# EasyEDA Pro project dipan参考PCB.epro

# Schematic Schematic1
Assembly Variant: Basic; Board Name: Board1; Create Date: 2026-07-19; Page Name: P1; Project Name: dipan3.0; Schematic Name: Schematic1; Update Date: 2026-07-19; Company: 嘉立创EDA; Page Size: A4; Version: V1.0
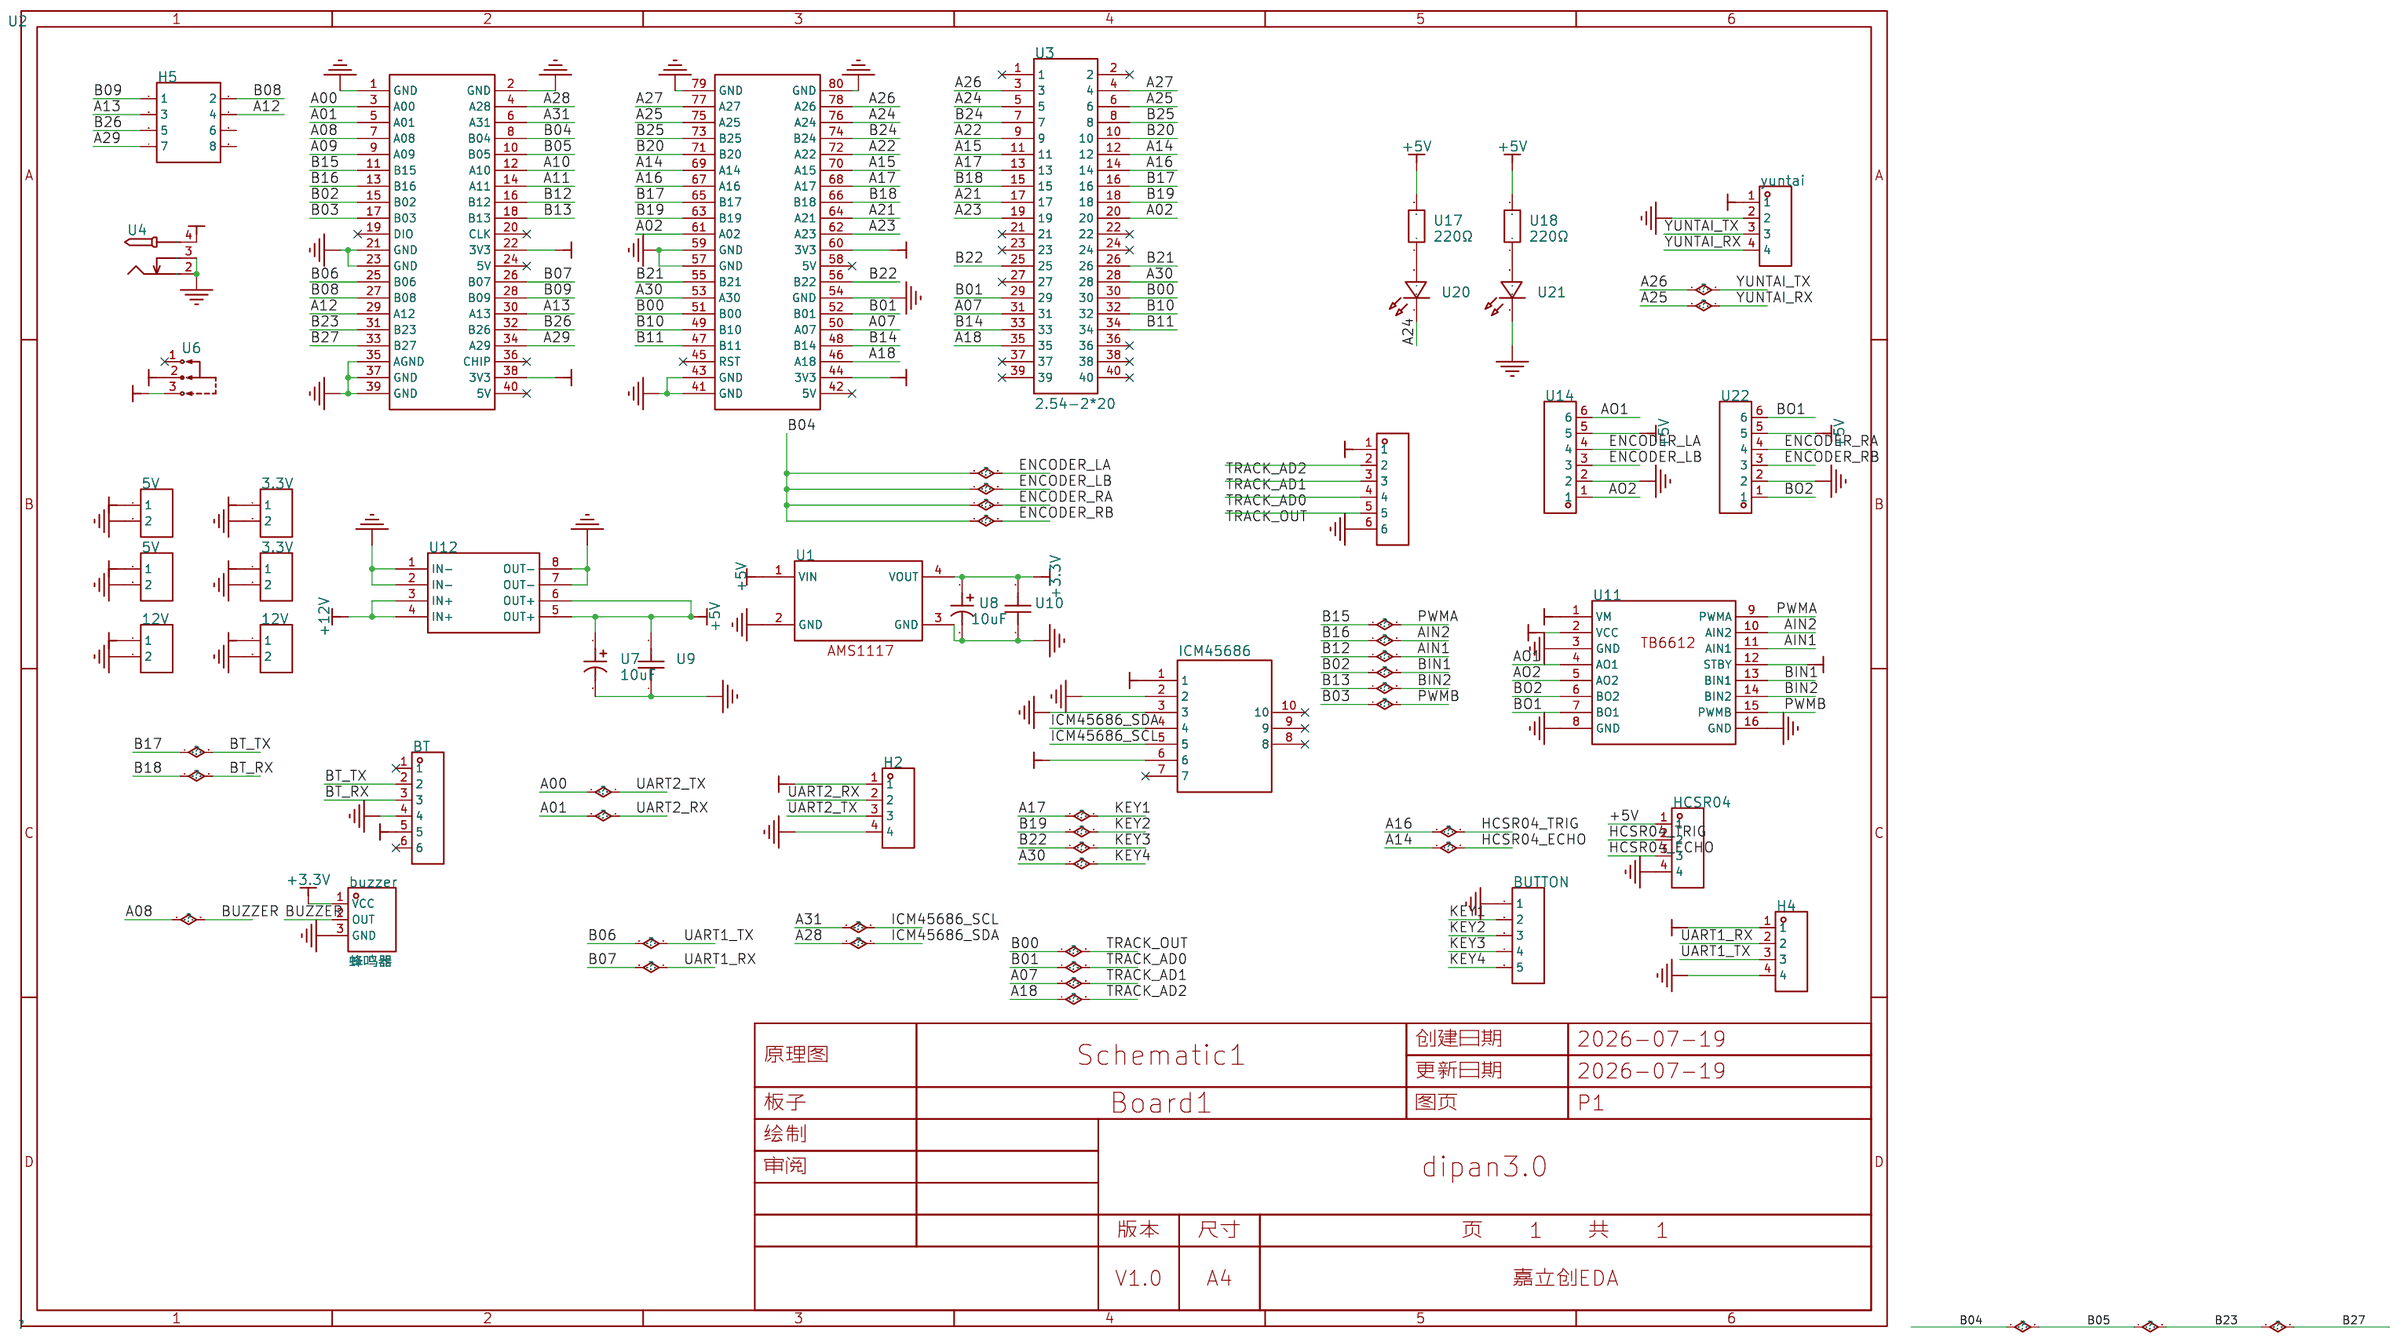
[diagram p0: schematic sheet]

## Parts
3.3V  -  [HDR-TH_2P-P2.54-V-F]
3.3V#2  -  [HDR-TH_2P-P2.54-V-F]
5V  -  [HDR-TH_2P-P2.54-V-F]
5V#2  -  [HDR-TH_2P-P2.54-V-F]
12V  -  [HDR-TH_2P-P2.54-V-F]
12V#2  -  [HDR-TH_2P-P2.54-V-F]
BT  -  [HDR-TH_6P-P2.54-V-F]
BUTTON  -  [HDR-TH_5P-P2.54-V-F]
buzzer  蜂鸣器  [蜂鸣器]
H2  -  [HDR-TH_4P-P2.54-V-F]
H4  -  [HDR-TH_4P-P2.54-V-F]
H5  -  [HDR-TH_8P-P2.54-V-F-R2-C4-S2.54-1]
HCSR04  -  [HDR-TH_4P-P2.54-V-F]
ICM45686  -  [ICM45686]
TRACK  -  [HDR-TH_6P-P2.54-V-F]
U1  -  [AMS1117模块]
U2  LCKFB-TMX-MSPM0G3507  [COMM-TH_LCKFB-TMX-MSPM0G3507]
U3  2.54-2*20  [HDR-TH_40P-P2.54-V-F-R2-C20-S2.54]
U4  DC005-2.5  [DC-IN-TH_DC005-2.5MM]
U6  SS12D10G5  [SW-TH_SHOU-HAN_SS12D10G4]
U7  10uF  [CAP-TH_BD5.0-P2.00-D0.5-FD-1]
U8  10uF  [CAP-TH_BD5.0-P2.00-D0.5-FD-1]
U9  -  [0.1uf陶瓷电容直插]
U10  -  [0.1uf陶瓷电容直插]
U11  -  [TB6612]
U12  -  [MP1584EN降压模块]
U14  ZX-XH2.54-6PWZ  [CONN-TH_6P-P2.50_ZX-XH2.54-6PWZ]
U17  220Ω  [RES-TH_BD2.7-L6.2-P10.20-D0.4]
U18  220Ω  [RES-TH_BD2.7-L6.2-P10.20-D0.4]
U20  LTL-307E  [LED-TH_BD3.0-P2.54-FD]
U21  LTL-307E  [LED-TH_BD3.0-P2.54-FD]
U22  ZX-XH2.54-6PWZ  [CONN-TH_6P-P2.50_ZX-XH2.54-6PWZ]
yuntai  -  [HDR-TH_4P-P2.54-V-F]

## Library data of the parts
3.3V 3.3V#2 5V 5V#2 12V 12V#2 = HDR-F_2.54_1x2P: Supplier Part: C49661; Supplier Footprint: 插件
BT TRACK = HDR-F_2.54_1x6P: Supplier Part: C40877; Supplier Footprint: 插件
BUTTON = HDR-F_2.54_1x5P: Supplier Part: C50950; Supplier Footprint: 插件
buzzer = 蜂鸣器: Supplier Part: C9900010938; Datasheet: https://atta.szlcsc.comnull; Supplier: LCSC
H2 H4 HCSR04 yuntai = HDR-F_2.54_1x4P: Supplier Part: C2718488; Supplier Footprint: 插件
H5 = HDR-F_2.54_2x4: Supplier Part: C92271; Supplier Footprint: 插件
ICM45686 = ICM45686
U1 = AMS1117模块: _: 3
U2 = LCKFB-TMX-MSPM0G3507: 该开发板板载德州仪器的微控制器核心,完美适配电赛指定TI芯片题目的要求。支持Keil、CCS和IAU等环境开发,搭配图形化代码生成工具,无需在意底层驱动,助力快速开发。硬件上带有多电源保护,防反接/防过流/受电压,和三路参考电压选择,降低电衰试错成本。80P引脚的引出方便扩展,提供完善的入门手册和模块移植案例。; LCSC Part Name: 5件套 立创·天猛星MSPM0G3507开发板; Supplier Part: C42378531; Manufacturer: 立创开发板; JLCPCB Part Class: Extended Part; Datasheet: https://item.szlcsc.com/datasheet/LCKFB-TMX-MSPM0G3507/44281600.html; Supplier: LCSC
U3 = 2.54-2*20: 插孔结构:2x20P;间距:2.54mm;行距:2.54mm;圆孔/方孔:方孔;安装类型:直插;排数:双排;总孔位数:40P;额定电流:2.5A;额定电压:-;插孔方向:顶部;塑高:8.5mm;工作温度范围:-40℃~+105℃;; LCSC Part Name: 间距:2.54mm 2x20P 直插; Supplier Part: C2977589; Manufacturer: ZHOURI(洲日); Supplier Footprint: 插件,P=2.54mm; JLCPCB Part Class: 扩展库; Datasheet: https://atta.szlcsc.com/upload/public/pdf/source/20220328/834E302BE3C038BBC5C70F5E02589B1E.pdf; Supplier: LCSC; Holes Structure: 2x20P; Pitch: 2.54mm; Row Spacing: 2.54mm; Circular Hole / Square Hole: 方孔; Mounting Type: 直插; Number of Rows: 双排; Number of Holes: 40P; Current Rating (Max): 2.5A; Holes Direction: 顶部; Insulation Height: 8.5mm; Operating Temperature Range: -40℃~+105℃
U4 = DC005-2.5: 连接器类型:DC电源插座;安装方式:弯插;触点内径:2.5mm;触点外径:6.3mm;额定电流:500mA;额定电压:30V;工作温度范围:-25℃~+70℃;; LCSC Part Name: DC电源插座 内径:2.5mm 外径:6.3mm; Supplier Part: C7507454; Manufacturer: SHOU HAN(首韩); Supplier Footprint: 插件; JLCPCB Part Class: 扩展库; Datasheet: https://atta.szlcsc.com/upload/public/pdf/source/20231013/7634FFE9E6B635EE77C0C008CDC877DB.pdf; Supplier: LCSC; Connector Type: DC电源插座; Mounting Style: 弯插; Inside Contact Diameter: 2.5mm; Outside Contact Diameter: 6.3mm; Current Rating (Max): 500mA; Voltage Rating (Max): 30V; Operating Temperature Range: -25℃~+70℃
U6 = SS12D10G5: 电路结构:单刀双掷;安装方式:直插;额定电流(DC):2A;额定电压(DC):125V;机械寿命:3千次;; LCSC Part Name: 两档立式插件 3脚拨动开关 柄长5.0mm; Supplier Part: C7431054; Manufacturer: SHOU HAN(首韩); Supplier Footprint: 插件; JLCPCB Part Class: 扩展库; Datasheet: https://atta.szlcsc.com/upload/public/pdf/source/20231130/7A3DB6A149BF0A1DCFFE64FFC07FE434.pdf; Supplier: LCSC; Circuit: 单刀双掷; Switch Length: 12.7mm; Switch Width: 6.7mm; Mounting Style: 直插; Current Rating (DC): 2A; Voltage Rating (DC): 125V; Mechanical Life: 3千次; Operating Temperature: -25℃~+70℃
U7 U8 = CV4R7MG511BP: 容值:4.7uF;精度:±20%;额定电压:50V;纹波电流:58mA@100kHz;等效串联电阻(ESR):2.5Ω@100kHz;; LCSC Part Name: 4.7uF ±20% 50V; Supplier Part: C2844413; Manufacturer: TWBOR(伯鸿); Supplier Footprint: 插件,D5xL11mm; JLCPCB Part Class: 扩展库; Datasheet: https://atta.szlcsc.com/upload/public/pdf/source/20210727/C2844413_0C02A797581ED1BB0754F03B8FF69A80.pdf; Supplier: LCSC; Tolerance: ±20%; Voltage Rating: 50V; Ripple Current: 58mA@100kHz; Equivalent Series Resistance(ESR): 2.5Ω@100kHz; Pin Spacing: 2mm; Diameter: 5mm; Height - Seated (Max): 11mm; Lifetime: 5000hrs@105℃; Operating Temperature: -40℃~+105℃
U9 U10 = 0.1uf陶瓷电容直插
U11 = TB6612
U12 = MP1584EN降压模块: _: 3
U14 U22 = ZX-XH2.54-6PWZ: 插针结构:1x6P;间距:2.5mm;安装方式:弯插;参考系列:XH;总PIN数:6P;排数:1;每排PIN数:6;行距:-;额定电流:2A;触头材质:黄铜;触头镀层:锡;工作温度:-25℃~+85℃;; LCSC Part Name: 1x6P 间距:2.5mm 弯插 系列:XH; Supplier Part: C7429645; Manufacturer: Megastar(兆星); Supplier Footprint: 弯插,P=2.5mm; JLCPCB Part Class: 扩展库; Datasheet: https://item.szlcsc.com/datasheet/ZX-XH2.54-6PWZ/8427562.html; Supplier: LCSC; Pins Structure: 1x6P; Pitch: 2.5mm; Mounting Type: 弯插; Reference Series: XH; Number of Pins: 6P; Number of Rows: 1; Number of PINs Per Row: 6; Current Rating: 2A; Contact Material: 黄铜; Contact Plating: 锡; Operating Temperature: -25℃~+85℃; Voltage Rating: 250V; Plastic Material: PA66; Flame Retardant Rating: UL94V-0; Color: 白色; Z-Height of the Board: 5.9mm; X-Length of Bottom Edge on Board (Spacing Line): 17.5mm; Y-Width of Bottom Edge on Board: 7.32mm
U17 U18 = MF1/4W-1K±1%-ST52: 电阻类型:金属膜电阻;阻值:1kΩ;精度:±1%;功率:250mW;温度系数:±100ppm/℃;; LCSC Part Name: 金属膜电阻 1kΩ ±1% 250mW; Supplier Part: C2903245; Manufacturer: VO(翔胜); Supplier Footprint: 插件,D2.7xL6.2mm; JLCPCB Part Class: 扩展库; Datasheet: https://atta.szlcsc.com/upload/public/pdf/source/20200609/C601728_5AA4C0C8E12E11069DA2C3356F29D1F2.pdf; Supplier: LCSC; Type: 金属膜电阻; Tolerance: ±1%; Overload Voltage (Max): 250V; Power(Watts): 250mW; Temperature Coefficient: ±100ppm/℃; Operating Temperature Range: -55℃~+155℃
U20 U21 = LTL-307E: 发光颜色:红色;正向电压(VF):2V;正向电流:20mA;主波长:623nm;透镜颜色:红色透镜;发光强度:19mcd;发光角度:50°;; LCSC Part Name: 直插F5红光LED; Supplier Part: C575489; Manufacturer: LITEON(光宝); Supplier Footprint: 插件; JLCPCB Part Class: 扩展库; Supplier: LCSC; Emitted Color: 红色; Forward Voltage (VF): 2V; Forward Current: 20mA; Dominant Wavelength: 623nm; Peak Wavelength: 635nm; Lens Color: 红色透镜; Luminous Intensity: 19mcd; Viewing Angle: 50°

## Nets
+3.3V: 3.3V.1 3.3V#2.1 buzzer.1(VCC) ICM45686.1 ICM45686.6 U1.4(VOUT) U2.22(3V3) U2.38(3V3) U2.44(3V3) U2.60(3V3) U8.1 U10.2
+5V: 5V.1 5V#2.1 BT.5 H2.1 H4.1 HCSR04.1 TRACK.1 U1.1(VIN) U7.1 U9.2 U11.2(VCC) U11.12(STBY) U12.5(OUT+) U12.6(OUT+) U14.5 U17.2 U18.2 U22.5 yuntai.1
+12V: 12V.1 12V#2.1 U6.3 U11.1(VM) U12.3(IN+) U12.4(IN+)
GND: 3.3V.2 3.3V#2.2 5V.2 5V#2.2 12V.2 12V#2.2 BT.4 BUTTON.1 buzzer.3(GND) H2.4 H4.4 HCSR04.4 ICM45686.2 ICM45686.3 TRACK.6 U1.2(GND) U1.3(GND) U2.1(GND) U2.2(GND) U2.21(GND) U2.23(GND) U2.35(AGND) U2.37(GND) U2.39(GND) U2.41(GND) U2.43(GND) U2.54(GND) U2.57(GND) U2.59(GND) U2.79(GND) U2.80(GND) U4.2 U4.3 U7.2 U8.2 U9.1 U10.1 U11.3(GND) U11.8(GND) U11.16(GND) U12.1(IN-) U12.2(IN-) U12.7(OUT-) U12.8(OUT-) U14.2 U21.1(C) U22.2 yuntai.2
VCC: U4.4 U6.2
A00: H2.3 U2.3(A00)
A01: H2.2 U2.5(A01)
A02: U2.61(A02) U3.20
A07: TRACK.3 U2.50(A07) U3.31
A08: buzzer.2(OUT) U2.7(A08)
A09: U2.9(A09)
A10: U2.12(A10)
A11: U2.14(A11)
A12: H5.4 U2.29(A12)
A13: H5.3 U2.30(A13)
A14: HCSR04.3 U2.69(A14) U3.12
A15: U2.70(A15) U3.11
A16: HCSR04.2 U2.67(A16) U3.14
A17: BUTTON.2 U2.68(A17) U3.13
A18: TRACK.2 U2.46(A18) U3.35
A21: U2.64(A21) U3.17
A22: U2.72(A22) U3.9
A23: U2.62(A23) U3.19
A24: U2.76(A24) U3.5 U20.1(C)
A25: U2.75(A25) U3.6 yuntai.4
A26: U2.78(A26) U3.3 yuntai.3
A27: U2.77(A27) U3.4
A28: ICM45686.4 U2.4(A28)
A29: H5.7 U2.34(A29)
A30: BUTTON.5 U2.53(A30) U3.28
A31: ICM45686.5 U2.6(A31)
AIN1: U2.16(B12) U11.11(AIN1)
AIN2: U2.13(B16) U11.10(AIN2)
AO1: U11.4(AO1) U14.6
AO2: U11.5(AO2) U14.1
B00: TRACK.5 U2.51(B00) U3.30
B01: TRACK.4 U2.52(B01) U3.29
B02: U2.15(B02) U11.13(BIN1)
B03: U2.17(B03) U11.15(PWMB)
B04: U2.8(B04) U2.10(B05) U2.31(B23) U2.33(B27) U14.3 U14.4 U22.3 U22.4
B06: H4.3 U2.25(B06)
B07: H4.2 U2.26(B07)
B08: H5.2 U2.27(B08)
B09: H5.1 U2.28(B09)
B10: U2.49(B10) U3.32
B11: U2.47(B11) U3.34
B13: U2.18(B13) U11.14(BIN2)
B14: U2.48(B14) U3.33
B15: U2.11(B15) U11.9(PWMA)
B17: BT.2 U2.65(B17) U3.16
B18: BT.3 U2.66(B18) U3.15
B19: BUTTON.3 U2.63(B19) U3.18
B20: U2.71(B20) U3.10
B21: U2.55(B21) U3.26
B22: BUTTON.4 U2.56(B22) U3.25
B24: U2.74(B24) U3.7
B25: U2.73(B25) U3.8
B26: H5.5 U2.32(B26)
BO1: U11.7(BO1) U22.6
BO2: U11.6(BO2) U22.1
$1N65: U18.1 U21.2(A)
$1N77: U17.1 U20.2(A)

Not connected (* = marked no-connect by the designer): BT 1* 6*; H5 6 8; ICM45686 7* 8* 9* 10*; U2 19(DIO)* 20(CLK)* 24(5V)* 36(CHIP)* 40(5V)* 42(5V)* 45(RST)* 58(5V)*; U3 1* 2* 21* 22* 23* 24* 27* 36* 37* 38* 39* 40*; U6 1*

# Board PCB1
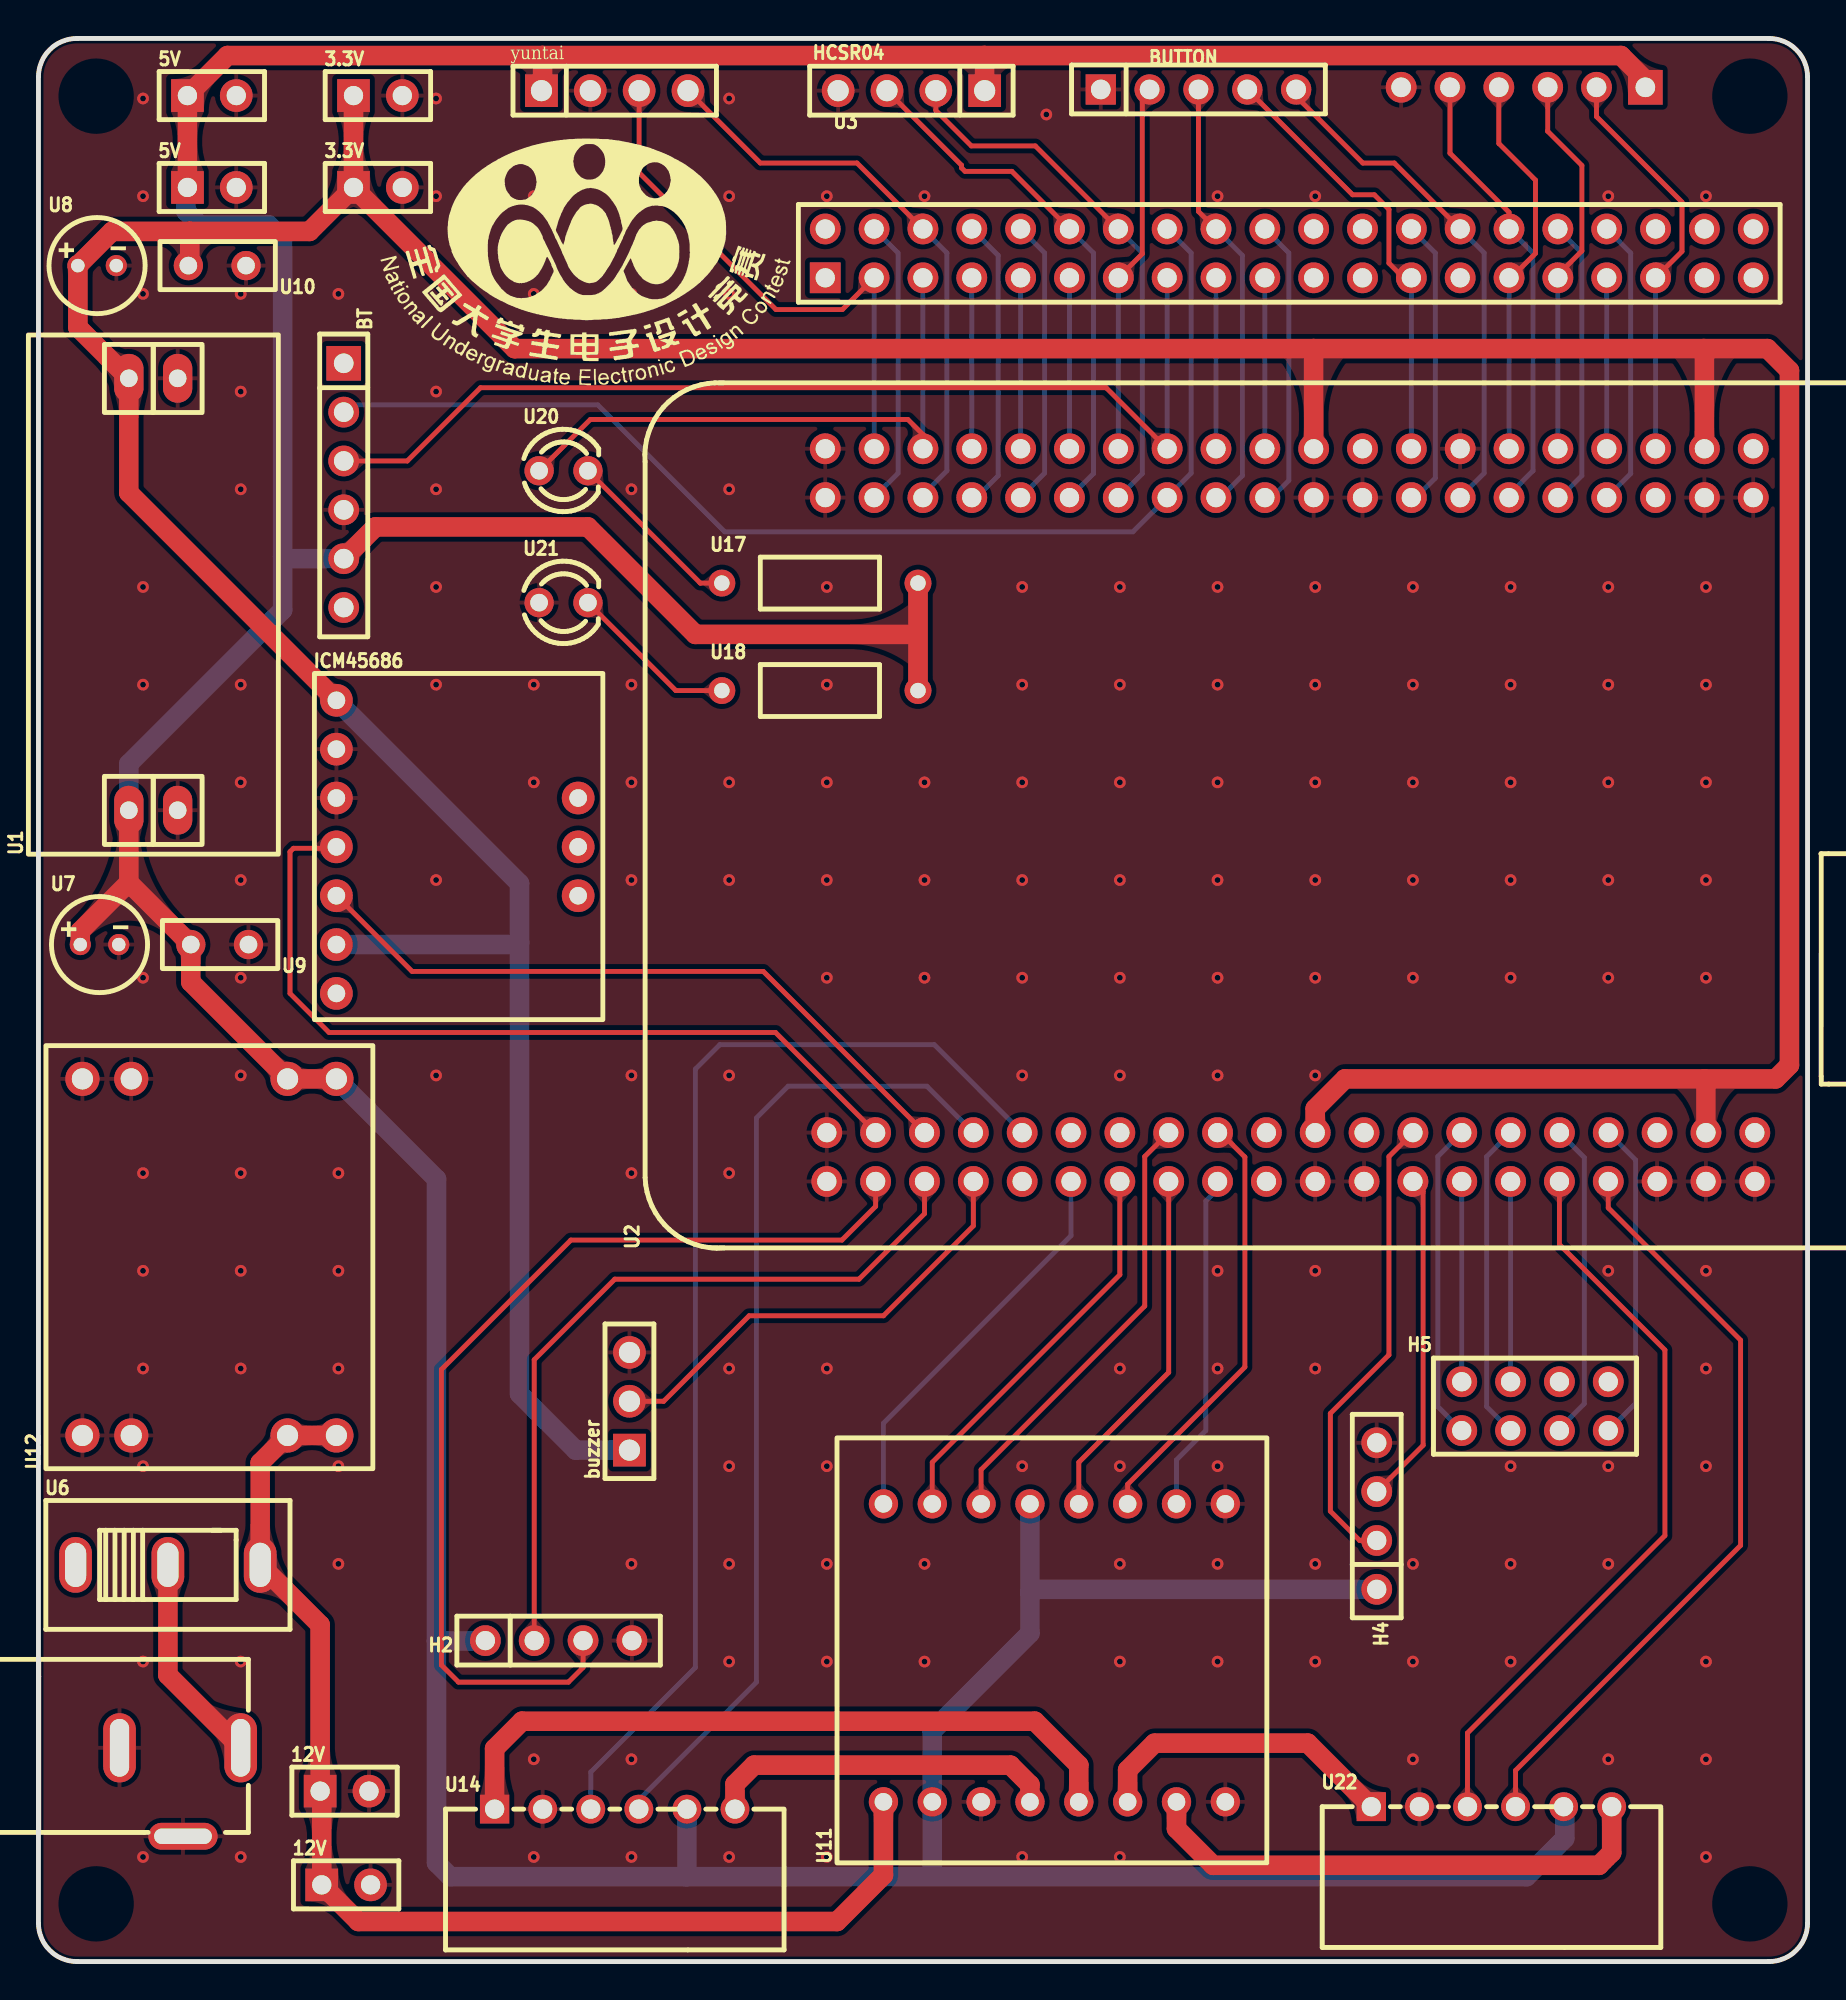
[diagram p1: board, top side]
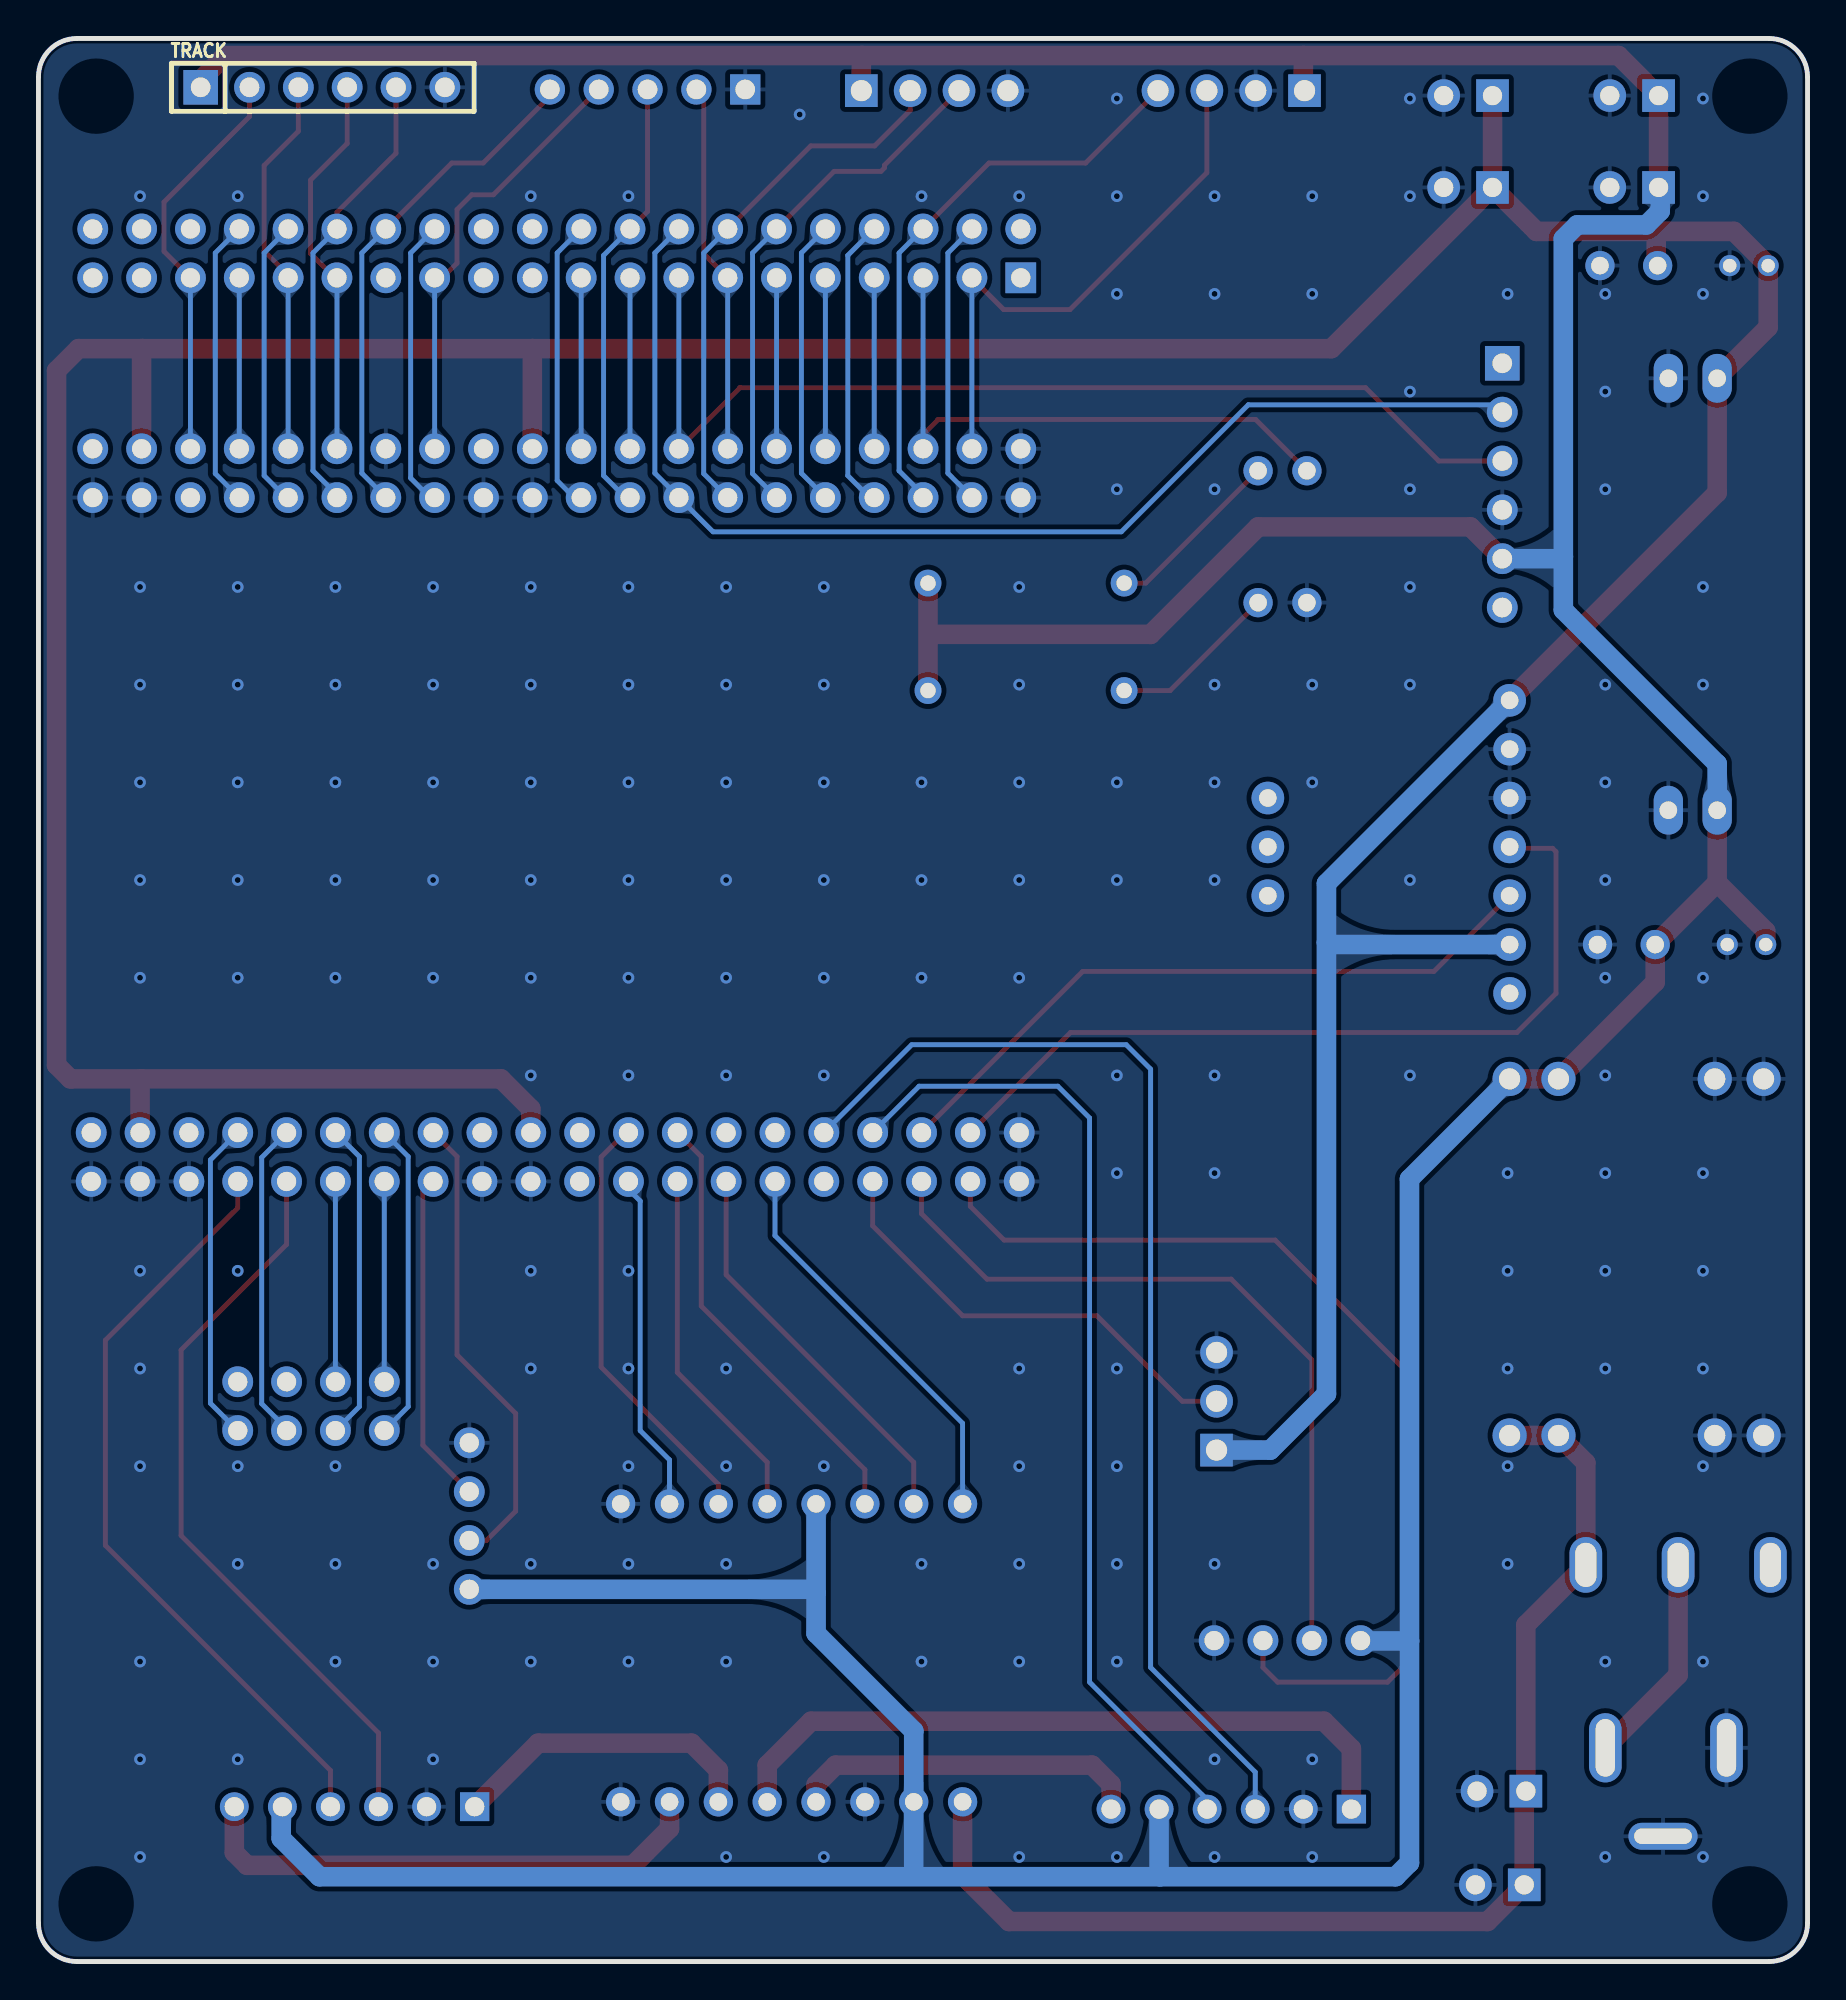
[diagram p2: board, bottom side, seen from below]

Outline 92 x 100 mm; copper layers: Top Layer, Bottom Layer. Coordinates in mm from the lower left corner of the outline.
Outline path: 0,98 0,2 arc(0.59,0.59) 2,0 90,0 arc(91.41,0.59) 92,2 92,98 arc(91.41,99.41) 90,100 2,100 arc(0.59,99.41) 0,98
Stack: Top Layer 0.035mm / Dielectric1 1.51mm FR4 er 4.5 / Bottom Layer 0.035mm

## Design rules (mm)
spacing copperThickness1oz (default): track to track 0.102, other pairs 0.152 to 0.3
spacing copperThickness2oz: track to track 0.203, other pairs 0.152 to 0.3
track width copperThickness1oz (default): min 0.127, default 0.254, max 2.54
track width copperThickness2oz: min 0.203, default 0.254, max 2.54
differential pair differentialPair (default): width min 0.127, default 0.254, max 2.54; gap min 0.152, default 0.152
net GND uses copperRegion

## Placement (name value [footprint] x y rotation side)
3.3V  -  [HDR-TH_2P-P2.54-V-F]  17.65 92.25 0 top
3.3V#2  -  [HDR-TH_2P-P2.54-V-F]  17.65 97.03 0 top
5V  -  [HDR-TH_2P-P2.54-V-F]  9.02 97.03 0 top
5V#2  -  [HDR-TH_2P-P2.54-V-F]  9.02 92.25 0 top
12V  -  [HDR-TH_2P-P2.54-V-F]  15.92 8.86 0 top
12V#2  -  [HDR-TH_2P-P2.54-V-F]  16 3.99 0 top
BT  -  [HDR-TH_6P-P2.54-V-F]  15.88 76.76 270 top
BUTTON  -  [HDR-TH_5P-P2.54-V-F]  60.32 97.35 0 top
buzzer  -  [蜂鸣器]  30.73 29.13 90 top
H2  -  [HDR-TH_4P-P2.54-V-F]  27.05 16.69 0 top
H4  -  [HDR-TH_4P-P2.54-V-F]  69.6 23.16 90 top
H5  -  [HDR-TH_8P-P2.54-V-F-R2-C4-S2.54-1]  77.83 28.88 0 top
HCSR04  -  [HDR-TH_4P-P2.54-V-F#2]  45.4 97.29 180 top
ICM45686  -  [ICM45686]  53.85 42.6 0 top
TRACK  -  [HDR-TH_6P-P2.54-V-F]  77.22 97.46 180 bottom
U1  -  [AMS1117模块]  5.97 70.54 90 top
U2  LCKFB-TMX-MSPM0G3507  [COMM-TH_LCKFB-TMX-MSPM0G3507]  65.09 59.61 90 top
U3  2.54-2*20  [HDR-TH_40P-P2.54-V-F-R2-C20-S2.54]  65.05 88.95 0 top
U4  DC005-2.5  [DC-IN-TH_DC005-2.5MM]  7.37 8.81 0 top
U6  SS12D10G5  [SW-TH_SHOU-HAN_SS12D10G4]  6.73 20.62 0 top
U7  10uF  [CAP-TH_BD5.0-P2.00-D0.5-FD-1]  3.17 52.88 0 top
U8  10uF  [CAP-TH_BD5.0-P2.00-D0.5-FD-1]  3.05 88.19 0 top
U9  -  [0.1uf陶瓷电容直插]  9.91 52.76 180 top
U10  -  [0.1uf陶瓷电容直插]  9.78 88.06 180 top
U11  -  [TB6612]  41.4 5 90 top
U12  -  [MP1584EN降压模块]  8.89 36.63 90 top
U14  ZX-XH2.54-6PWZ  [CONN-TH_6P-P2.50_ZX-XH2.54-6PWZ]  29.97 7.93 0 top
U17  220Ω  [RES-TH_BD2.7-L6.2-P10.20-D0.4]  40.64 71.68 0 top
U18  220Ω  [RES-TH_BD2.7-L6.2-P10.20-D0.4]  40.64 66.09 0 top
U20  LTL-307E  [LED-TH_BD3.0-P2.54-FD]  27.31 77.52 0 top
U21  LTL-307E  [LED-TH_BD3.0-P2.54-FD]  27.31 70.66 0 top
U22  ZX-XH2.54-6PWZ  [CONN-TH_6P-P2.50_ZX-XH2.54-6PWZ]  75.56 8.05 0 top
yuntai  -  [HDR-TH_4P-P2.54-V-F#2]  29.97 97.29 0 top

## Footprints (pads in the part's own frame, mm; a bottom-side part is the same pattern mirrored in y, then rotated)
0.1uf陶瓷电容直插
  round 1.524 hole 0.914: 1(-1.016,-0.127) 2(1.984,-0.127)
AMS1117模块
  oval 2.54x1.524 hole 0.914: 1(-10.668,1.27) 2(-10.668,-1.27) 3(11.792,-1.27) 4(11.792,1.27)
CAP-TH_BD5.0-P2.00-D0.5-FD-1
  round 1.1 hole 0.7: 1(-1,0) 2(1,0)
COMM-TH_LCKFB-TMX-MSPM0G3507
  round 1.6 hole 1: 1(-19.05,24.09) 2(-16.51,24.09) 3(-19.05,21.549) 4(-16.51,21.549) 5(-19.05,19.009) 6(-16.51,19.009) 7(-19.05,16.47) 8(-16.51,16.47) 9(-19.05,13.93) 10(-16.51,13.93) 11(-19.05,11.389) 12(-16.51,11.389) 13(-19.05,8.85) 14(-16.51,8.85) 15(-19.05,6.309) 16(-16.51,6.309) 17(-19.05,3.769) 18(-16.51,3.769) 19(-19.05,1.23) 20(-16.51,1.23) 21(-19.05,-1.31) 22(-16.51,-1.31) 23(-19.05,-3.85) 24(-16.51,-3.85) 25(-19.05,-6.391) 26(-16.51,-6.391) 27(-19.05,-8.931) 28(-16.51,-8.931) 29(-19.05,-11.47) 30(-16.51,-11.47) 31(-19.05,-14.011) 32(-16.51,-14.011) 33(-19.05,-16.55) 34(-16.51,-16.55) 35(-19.05,-19.09) 36(-16.51,-19.09) 37(-19.05,-21.631) 38(-16.51,-21.631) 39(-19.05,-24.171) 40(-16.51,-24.171) 41(16.51,-24.09) 42(19.05,-24.09) 43(16.51,-21.549) 44(19.05,-21.549) 45(16.51,-19.009) 46(19.05,-19.009) 47(16.51,-16.47) 48(19.05,-16.47) 49(16.51,-13.93) 50(19.05,-13.93) 51(16.51,-11.389) 52(19.05,-11.389) 53(16.51,-8.85) 54(19.05,-8.85) 55(16.51,-6.309) 56(19.05,-6.309) 57(16.51,-3.769) 58(19.05,-3.769) 59(16.51,-1.23) 60(19.05,-1.23) 61(16.51,1.31) 62(19.05,1.31) 63(16.51,3.85) 64(19.05,3.85) 65(16.51,6.391) 66(19.05,6.391) 67(16.51,8.931) 68(19.05,8.931) 69(16.51,11.47) 70(19.05,11.47) 71(16.51,14.011) 72(19.05,14.011) 73(16.51,16.55) 74(19.05,16.55) 75(16.51,19.09) 76(19.05,19.09) 77(16.51,21.631) 78(19.05,21.631) 79(16.51,24.171) 80(19.05,24.171)
CONN-TH_6P-P2.50_ZX-XH2.54-6PWZ
  rect 1.524x1.5 hole 1: 1(-6.25,0)
  round 1.5 hole 1: 2(-3.75,0) 3(-1.25,0) 4(1.25,0) 5(3.75,0) 6(6.25,0)
DC-IN-TH_DC005-2.5MM
  oval 3.6x1.4 hole 3x0.8: 2(0.15,-2.3)
  oval 1.7x3.6 hole 1x3: 3(-3.15,2.3) 4(3.15,2.3)
HDR-TH_2P-P2.54-V-F
  rect 1.7x1.7 hole 1: 1(-1.27,0)
  round 1.7 hole 1: 2(1.27,0)
HDR-TH_4P-P2.54-V-F
  round 1.6 hole 1: 1(-3.81,0) 2(-1.27,0) 3(1.27,0) 4(3.81,0)
HDR-TH_4P-P2.54-V-F#2
  rect 1.7x1.7 hole 1.1: 1(-3.81,0)
  round 1.7 hole 1.1: 2(-1.27,0) 3(1.27,0) 4(3.81,0)
HDR-TH_5P-P2.54-V-F
  rect 1.575x1.575 hole 1.02: 1(-5.08,0)
  round 1.575 hole 1.02: 2(-2.54,0) 3(0,0) 4(2.54,0) 5(5.08,0)
HDR-TH_6P-P2.54-V-F
  rect 1.8x1.8 hole 1.02: 1(-6.35,0)
  round 1.6 hole 1.02: 2(-3.81,0) 3(-1.27,0) 4(1.27,0) 5(3.81,0) 6(6.35,0)
HDR-TH_8P-P2.54-V-F-R2-C4-S2.54-1
  round 1.6 hole 1: 1(-3.81,-1.27) 2(-3.81,1.27) 3(-1.27,-1.27) 4(-1.27,1.27) 5(1.27,-1.27) 6(1.27,1.27) 7(3.81,-1.27) 8(3.81,1.27)
HDR-TH_40P-P2.54-V-F-R2-C20-S2.54
  rect 1.6x1.6 hole 1: 1(-24.13,-1.397)
  round 1.6 hole 1: 2(-24.13,1.143) 3(-21.59,-1.397) 4(-21.59,1.143) 5(-19.05,-1.397) 6(-19.05,1.143) 7(-16.51,-1.397) 8(-16.51,1.143) 9(-13.97,-1.397) 10(-13.97,1.143) 11(-11.43,-1.397) 12(-11.43,1.143) 13(-8.89,-1.397) 14(-8.89,1.143) 15(-6.35,-1.397) 16(-6.35,1.143) 17(-3.81,-1.397) 18(-3.81,1.143) 19(-1.27,-1.397) 20(-1.27,1.143) 21(1.27,-1.397) 22(1.27,1.143) 23(3.81,-1.397) 24(3.81,1.143) 25(6.35,-1.397) 26(6.35,1.143) 27(8.89,-1.397) 28(8.89,1.143) 29(11.43,-1.397) 30(11.43,1.143) 31(13.97,-1.397) 32(13.97,1.143) 33(16.51,-1.397) 34(16.51,1.143) 35(19.05,-1.397) 36(19.05,1.143) 37(21.59,-1.397) 38(21.59,1.143) 39(24.13,-1.397) 40(24.13,1.143)
ICM45686
  round 1.7 hole 0.914: 1(-38.354,22.987) 2(-38.354,20.447) 3(-38.354,17.907) 4(-38.354,15.367) 5(-38.354,12.827) 6(-38.354,10.287) 7(-38.354,7.747) 8(-25.781,17.907) 9(-25.781,15.367) 10(-25.781,12.827)
LED-TH_BD3.0-P2.54-FD
  round 1.524 hole 0.914: 1(-1.27,0) 2(1.27,0)
MP1584EN降压模块
  round 1.778 hole 1.1: 1(-9.271,6.604) 2(-9.271,4.064) 3(-9.271,-4.064) 4(-9.271,-6.604) 5(9.271,-6.604) 6(9.271,-4.064) 7(9.271,4.064) 8(9.271,6.604)
RES-TH_BD2.7-L6.2-P10.20-D0.4
  round 1.4 hole 0.8: 1(-5.1,0) 2(5.1,0)
SW-TH_SHOU-HAN_SS12D10G4
  oval 1.7x2.9 hole 1.1x2.3: 1(-4.8,0) 2(0,0) 3(4.8,0)
TB6612
  round 1.524 hole 0.914: 1(3.302,-2.54) 2(3.3,-5.08) 3(3.3,-7.62) 4(3.3,-10.16) 5(3.3,-12.7) 6(3.3,-15.24) 7(3.3,-17.78) 8(3.3,-20.32) 9(18.796,-2.54) 10(18.796,-5.08) 11(18.796,-7.62) 12(18.796,-10.16) 13(18.796,-12.7) 14(18.796,-15.24) 15(18.796,-17.78) 16(18.796,-20.32)
蜂鸣器
  rect 1.7x1.7 hole 1.1: 1(-2.54,0)
  round 1.7 hole 1.1: 2(0,0) 3(2.54,0)

## Nets
As in the schematic, except:
B04: U2.8 U14.4
B05: U2.10 U14.3
B23: U2.31 U22.3
B27: U2.33 U22.4

Pads without a net: BT 1 6; H5 6 8; ICM45686 7 8 9 10; U2 19 20 24 36 40 42 45 58; U3 1 2 21 22 23 24 27 36 37 38 39 40; U6 1

## Via types
v1: diameter 0.61, hole 0.305, Top Layer to Bottom Layer, 167 vias

## Routing (per net, layer and track width the routed paths; a pad name or vN(x,y) marks a point on that pad's centre or on a via; arc(x,y) is an arc through that point)
+3.3V: length 262.1
  Top Layer w1.016: 66.31,83.87 86.6,83.87 ; 66.31,83.87 66.32,83.86 U2.60 ; 66.31,83.87 24.77,83.87 3.3V.1 ; 86.6,83.87 86.64,83.84 U2.44 ; 86.6,83.87 89.92,83.87 91.06,82.73 91.06,46.62 90.34,45.9 86.65,45.9 ; 7.87,89.97 3.83,89.97 U8.1 2.05,84.98 U1.4 4.7,76.38 ICM45686.1 ; 7.87,89.97 7.87,88.26 U10.2 ; 7.87,89.97 14.1,89.97 3.3V.1 ; 3.3V.1 3.3V#2.1 ; 86.65,45.9 86.72,45.83 86.72,43.1 ; 86.65,45.9 67.94,45.9 66.4,44.35 66.4,43.1
  Bottom Layer w1.016: 25.02,52.99 24.92,52.88 ICM45686.6 ; 25.02,52.99 25.02,56.06 ICM45686.1 ; 25.02,52.99 25.02,29.51 27.94,26.59 buzzer.1
+5V: length 341.4
  Top Layer w1.016: yuntai.1 26.22,97.35 26.22,99.11 ; 4.7,56.11 U1.1 ; 4.7,56.11 2.17,53.58 U7.1 ; 4.7,56.11 U9.2 7.92,50.93 U12.6 U12.5 ; 5V#2.1 5V.1 9.83,99.11 26.22,99.11 ; 26.22,99.11 49.18,99.11 ; 49.18,99.11 49.21,99.09 HCSR04.1 ; 49.18,99.11 82.3,99.11 83.57,97.84 TRACK.1 ; BT.5 17.53,74.6 28.57,74.6 34.16,69.01 45.47,69.01 ; U17.2 U18.2
  Bottom Layer w1.016: U22.5 79.38,7.99 79.38,6.4 77.39,4.41 33.69,4.41 ; 33.69,4.41 21.42,4.41 20.7,5.13 20.7,16.67 ; 33.69,4.41 33.72,4.44 U14.5 ; 12.7,73.05 12.7,89.59 11.98,90.3 8.38,90.3 7.66,91.02 7.66,92.17 5V#2.1 ; 12.7,73.05 12.7,70.28 4.7,62.28 U1.1 ; 12.7,73.05 12.8,72.95 BT.5 ; 51.56,19.18 51.56,17.07 46.48,11.99 U11.2 46.48,4.62 ; 51.56,19.18 51.73,19.35 H4.1 ; 51.56,19.18 U11.12 ; U12.5 20.7,40.69 20.7,16.67 ; H2.1 23.22,16.67 20.7,16.67
+12V: length 62.6
  Top Layer w1.016: U11.1 43.94,4.5 41.53,2.08 16.64,2.08 12V#2.1 14.73,8.78 12V.1 14.65,17.51 11.53,20.62 11.53,25.93 U12.3 U12.4
GND:
  vias: v1(5.44,96.88) v1(5.44,91.8) v1(5.44,86.72) v1(5.44,71.48) v1(5.44,66.4) v1(5.44,51.16) v1(5.44,41) v1(5.44,35.92) v1(5.44,30.84) v1(5.44,25.76) v1(5.44,15.6) v1(5.44,5.44) v1(10.52,86.72) v1(10.52,81.64) v1(10.52,76.56) v1(10.52,66.4) v1(10.52,61.32) v1(10.52,56.24) v1(10.52,51.16) v1(10.52,46.08) v1(10.52,41) v1(10.52,35.92) v1(10.52,30.84) v1(10.52,15.6) v1(10.52,5.44) v1(15.6,86.72) v1(15.6,41) v1(15.6,35.92) v1(15.6,30.84) v1(15.6,25.76) v1(15.6,20.68) v1(20.68,96.88) v1(20.68,91.8) v1(20.68,81.64) v1(20.68,76.56) v1(20.68,71.48) v1(20.68,66.4) v1(20.68,56.24) v1(20.68,46.08) v1(25.76,91.8) v1(25.76,86.72) v1(25.76,66.4) v1(25.76,61.32) v1(25.76,10.52) v1(25.76,5.44) v1(30.84,91.8) v1(30.84,86.72) v1(30.84,76.56) v1(30.84,66.4) v1(30.84,61.32) v1(30.84,56.24) v1(30.84,46.08) v1(30.84,41) v1(30.84,20.68) v1(30.84,10.52) v1(30.84,5.44) v1(35.92,96.88) v1(35.92,91.8) v1(35.92,86.72) v1(35.92,76.56) v1(35.92,61.32) v1(35.92,56.24) v1(35.92,46.08) v1(35.92,41) v1(35.92,30.84) v1(35.92,25.76) v1(35.92,20.68) v1(35.92,15.6) v1(35.92,5.44) v1(41,91.8) v1(41,71.48) v1(41,66.4) v1(41,61.32) v1(41,56.24) v1(41,51.16) v1(41,30.84) v1(41,25.76) v1(41,20.68) v1(41,15.6) v1(41,5.44) v1(46.08,91.8) v1(46.08,61.32) v1(46.08,56.24) v1(46.08,51.16) v1(46.08,20.68) v1(46.08,15.6) v1(51.16,71.48) v1(51.16,66.4) v1(51.16,61.32) v1(51.16,56.24) v1(51.16,51.16) v1(51.16,46.08) v1(51.16,25.76) v1(51.16,5.44) v1(52.41,96.05) v1(56.24,71.48) v1(56.24,66.4) v1(56.24,61.32) v1(56.24,56.24) v1(56.24,51.16) v1(56.24,46.08) v1(56.24,30.84) v1(56.24,25.76) v1(56.24,20.68) v1(56.24,15.6) v1(56.24,5.44) v1(61.32,91.8) v1(61.32,71.48) v1(61.32,66.4) v1(61.32,61.32) v1(61.32,56.24) v1(61.32,51.16) v1(61.32,46.08) v1(61.32,35.92) v1(61.32,30.84) v1(61.32,25.76) v1(61.32,20.68) v1(61.32,15.6) v1(66.4,91.8) v1(66.4,71.48) v1(66.4,66.4) v1(66.4,61.32) v1(66.4,56.24) v1(66.4,51.16) v1(66.4,46.08) v1(66.4,35.92) v1(66.4,30.84) v1(66.4,20.68) v1(66.4,15.6) v1(71.48,71.48) v1(71.48,66.4) v1(71.48,61.32) v1(71.48,56.24) v1(71.48,51.16) v1(71.48,20.68) v1(71.48,15.6) v1(71.48,10.52) v1(76.56,71.48) v1(76.56,66.4) v1(76.56,61.32) v1(76.56,56.24) v1(76.56,51.16) v1(76.56,25.76) v1(76.56,20.68) v1(76.56,15.6) v1(81.64,91.8) v1(81.64,71.48) v1(81.64,66.4) v1(81.64,61.32) v1(81.64,56.24) v1(81.64,51.16) v1(81.64,35.92) v1(81.64,25.76) v1(81.64,20.68) v1(81.64,10.52) v1(86.72,91.8) v1(86.72,71.48) v1(86.72,66.4) v1(86.72,61.32) v1(86.72,56.24) v1(86.72,51.16) v1(86.72,35.92) v1(86.72,30.84) v1(86.72,25.76) v1(86.72,15.6) v1(86.72,10.52) v1(86.72,5.44)
VCC: length 11.1
  Top Layer w1.016: U6.2 6.73,14.9 U4.4
A00: length 52.2
  Top Layer w0.254: H2.3 28.32,15.29 27.56,14.53 21.84,14.53 20.95,15.42 20.95,30.78 27.69,37.52 41.78,37.52 43.54,39.27 43.54,40.56
A01: length 39.7
  Top Layer w0.254: 46.08,40.56 46.08,38.89 42.67,35.48 29.97,35.48 25.78,31.29 H2.2
A02: length 15.2
  Bottom Layer w0.254: U3.20 65.02,88.85 65.02,77.01 64.13,76.12 U2.61
A07: length 20
  Top Layer w0.254: TRACK.3 78.49,95.17 80.26,93.4 80.26,88.95 79.02,87.7 U3.31
  Bottom Layer w0.254: U3.31 U2.50
A08: length 24
  Top Layer w0.254: 48.62,40.56 48.62,38.25 43.94,33.58 36.96,33.58 32.51,29.13 buzzer.2
A12: length 10.4
  Bottom Layer w0.254: 76.56,40.56 H5.4
A13: length 16.5
  Bottom Layer w0.254: H5.3 75.31,28.86 75.31,41.86 76.56,43.1
A14: length 27.6
  Top Layer w0.254: U3.12 50.62,93.09 48.19,93.09 48.01,93.27 48.01,93.41 44.13,97.29
  Bottom Layer w0.254: U3.12 54.86,88.85 54.86,77.37 U2.69
A15: length 8.9
  Bottom Layer w0.254: U3.11 U2.70
A16: length 28.1
  Top Layer w0.254: HCSR04.2 46.67,96.26 48.51,94.41 51.84,94.41 U3.14
  Bottom Layer w0.254: U3.14 57.4,88.85 57.4,77.37 U2.67
A17: length 19.4
  Top Layer w0.254: BUTTON.2 57.4,96.97 57.4,88.8 U3.13
  Bottom Layer w0.254: U3.13 U2.68
A18: length 21.2
  Top Layer w0.254: U3.35 85.47,88.93 85.47,91.49 81.03,95.94 TRACK.2
  Bottom Layer w0.254: U3.35 U2.46
A21: length 8.9
  Bottom Layer w0.254: U3.17 U2.64
A22: length 8.9
  Bottom Layer w0.254: U3.9 U2.72
A23: length 8.9
  Bottom Layer w0.254: U3.19 U2.62
A24: length 31
  Top Layer w0.254: U20.1 28.7,80.19 45.21,80.19 46,79.4 U2.76
  Bottom Layer w0.254: U3.5 U2.76
A25: length 30.2
  Top Layer w0.254: U3.6 42.57,93.52 37.54,93.52 yuntai.4
  Bottom Layer w0.254: U2.75 46,76.27 47.24,77.52 47.24,88.85 U3.6
A26: length 29
  Top Layer w0.254: yuntai.3 31.24,93.02 38.35,85.9 41.81,85.9 U3.3
  Bottom Layer w0.254: U3.3 U2.78
A27: length 15
  Bottom Layer w0.254: U2.77 43.46,76.15 44.7,77.39 44.7,88.85 U3.4
A28: length 43.3
  Top Layer w0.254: ICM45686.4 15.42,57.89 13.26,57.89 13.08,57.71 13.08,50.34 15.11,48.31 38.33,48.31 43.54,43.1
A29: length 16.7
  Bottom Layer w0.254: H5.7 83.06,29.03 83.06,41.68 81.64,43.1
A30: length 26.8
  Top Layer w0.254: BUTTON.5 65.41,96.99 68.87,93.52 70.51,93.52 U3.28
  Bottom Layer w0.254: U3.28 75.18,88.85 75.18,77.39 73.94,76.15 U2.53
A31: length 35.7
  Top Layer w0.254: 46.08,43.1 37.69,51.49 19.43,51.49 ICM45686.5
AIN1: length 23.3
  Top Layer w0.254: 58.78,43.1 57.53,41.86 57.53,34.09 49.02,25.58 U11.11
AIN2: length 20.8
  Top Layer w0.254: 56.24,40.56 56.24,35.71 46.48,25.96 U11.10
AO1: length 18.4
  Top Layer w1.016: U11.4 51.56,9.19 50.55,10.21 37.21,10.21 36.22,9.22 U14.6
AO2: length 37
  Top Layer w1.016: U11.5 54.1,10.21 51.82,12.5 25.15,12.5 23.72,11.07 U14.1
B00: length 23.6
  Top Layer w0.254: TRACK.5 73.41,94.03 76.48,90.96 U3.30
  Bottom Layer w0.254: U3.30 77.72,88.85 77.72,77.52 76.48,76.27 U2.51
B01: length 20.2
  Top Layer w0.254: TRACK.4 75.95,94.54 77.85,92.63 77.85,88.82 76.58,87.55 U3.29
  Bottom Layer w0.254: U3.29 U2.52
B02: length 18.7
  Top Layer w0.254: U11.13 54.1,25.96 58.78,30.63 58.78,40.56
B03: length 17.6
  Bottom Layer w0.254: U11.15 59.18,26.09 60.71,27.61 60.71,39.55 61.32,40.16 61.32,40.56
B04: length 51.4
  Bottom Layer w0.254: U14.4 31.22,8.41 37.34,14.53 37.34,43.87 38.99,45.52 46.2,45.52 48.62,43.1
B05: length 60.1
  Bottom Layer w0.254: U14.3 28.72,9.85 34.16,15.29 34.16,46.41 35.43,47.68 46.59,47.68 51.16,43.1
B06: length 17.3
  Top Layer w0.254: H4.3 72.01,26.85 72.01,40.03 71.48,40.56
B07: length 24.5
  Top Layer w0.254: 69.6,21.9 68.71,21.9 67.18,23.42 67.18,28.5 70.23,31.55 70.23,41.86 71.48,43.1
B08: length 10.4
  Bottom Layer w0.254: 74.02,40.56 H5.2
B09: length 16.5
  Bottom Layer w0.254: H5.1 72.77,28.86 72.77,41.86 74.02,43.1
B10: length 15.1
  Bottom Layer w0.254: U2.49 79.12,76.12 80.26,77.27 80.26,88.85 U3.32
B11: length 15
  Bottom Layer w0.254: U2.47 82.8,77.37 82.8,88.85 U3.34
B13: length 22.5
  Top Layer w0.254: U11.14 56.64,24.82 62.74,30.91 62.74,41.83 61.47,43.1 61.32,43.1
B14: length 8.9
  Bottom Layer w0.254: U3.33 U2.48
B15: length 20.8
  Bottom Layer w0.254: 53.7,40.56 53.7,37.75 43.94,27.99 U11.9
B17: length 61.5
  Bottom Layer w0.254: BT.2 16.26,80.95 29.08,80.95 35.69,74.35 56.92,74.35 U2.65 58.7,76.15 59.94,77.39 59.94,88.85 U3.16
B18: length 54.6
  Top Layer w0.254: BT.3 19.18,78.03 22.99,81.84 55.52,81.84 U2.66
  Bottom Layer w0.254: U3.15 U2.66
B19: length 22.9
  Top Layer w0.254: U3.18 60.32,91.01 BUTTON.3
  Bottom Layer w0.254: U2.63 61.47,76.12 62.61,77.27 62.61,88.72 U3.18
B20: length 15
  Bottom Layer w0.254: U2.71 51.08,76.15 52.32,77.39 52.32,88.85 U3.10
B21: length 15.1
  Bottom Layer w0.254: U2.55 71.63,76.12 72.64,77.14 72.64,88.85 U3.26
B22: length 23.1
  Top Layer w0.254: U3.25 70.99,87.55 70.23,88.32 70.23,91.11 69.47,91.87 68.34,91.87 BUTTON.4
  Bottom Layer w0.254: U3.25 U2.56
B23: length 39
  Top Layer w0.254: U22.3 74.31,11.88 84.58,22.15 84.58,31.8 79.1,37.29 79.1,40.56
B24: length 8.9
  Bottom Layer w0.254: U3.7 U2.74
B25: length 15.2
  Bottom Layer w0.254: U2.73 48.77,76.12 49.91,77.27 49.91,88.72 U3.8
B26: length 16.6
  Bottom Layer w0.254: 79.1,43.1 80.39,41.81 80.39,29.01 79.1,27.71 H5.5
B27: length 40.2
  Top Layer w0.254: U22.4 76.81,9.94 88.52,21.64 88.52,32.31 81.64,39.19 81.64,40.56
BO1: length 27.5
  Top Layer w1.016: U22.6 81.81,5.67 81.15,5 61.09,5 59.18,6.91 U11.7
BO2: length 16.3
  Top Layer w1.016: U11.6 56.64,9.96 58.04,11.35 66.01,11.35 U22.1
$1N65: length 8.9
  Top Layer w0.254: 28.57,70.66 33.15,66.09 U18.1
$1N77: length 9.4
  Top Layer w0.254: 28.57,77.52 34.42,71.68 U17.1

## Copper pours and planes (outline as drawn; the poured copper is in the pictures)
GND on Top Layer: -4.83,103.05 97.54,103.05 97.54,-3.12 -4.83,-3.12
GND on Bottom Layer: -7.87,105.08 98.55,105.08 98.55,-4.01 -7.87,-4.01

Small or netless copper shapes (teardrops, artwork), in the pictures only: 114 on Top Layer, 98 on Bottom Layer
